# Altium project PCB_Project1.PrjPCB (part 2 of 2)
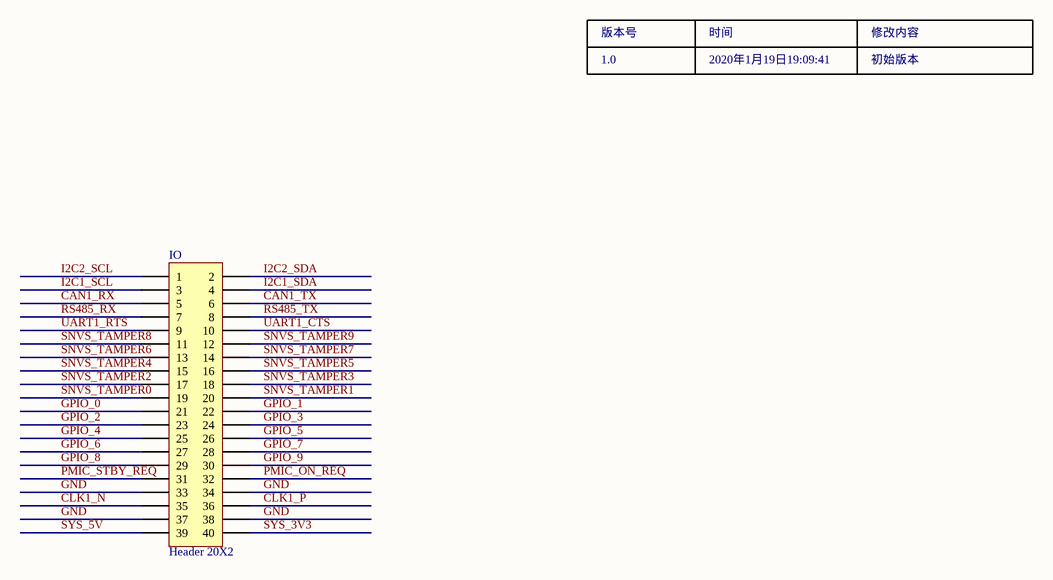
[diagram p12: 12_IO.SchDoc]

## Nets that join several sheets
DCDC_3V3: 01_POWER (10 pins), 02_BTB_IO (U3.77 U3.78 U3.79 U3.80)
GND: 01_POWER (23 pins), 02_BTB_IO (43 pins), 03_ENET (29 pins), 05_USB (25 pins), 06_SDIO (11 pins), 07_AUDIO (36 pins), 08_PERIPHERAL (31 pins), 09_RGB_LCD (LCD.5 LCD.36), 10_HDMI (31 pins), 11_HDMI_CON (13 pins), 12_IO (IO.33 IO.34 IO.37 IO.38)
JTAG_5V: 01_POWER (D3.1), 02_BTB_IO (P2.10)
SYS_3V3: 01_POWER (Q11.3 R9.2), 02_BTB_IO (C102.2 R10.2 SPI.7), 03_ENET (C10.2 L3.1), 04_BOOT (8 pins), 05_USB (C28.1 R46.2 U6.4 U6.16), 06_SDIO (Q6.2 R55.1 R57.1 SW_WIFI.1), 07_AUDIO (7 pins), 08_PERIPHERAL (23 pins), 09_RGB_LCD (5 pins), 10_HDMI (13 pins), 11_HDMI_CON (D12.1), 12_IO (IO.40)
SYS_5V: 01_POWER (5 pins), 02_BTB_IO (U3.150), 05_USB (10 pins), 07_AUDIO (C46.1 C47.1 U9.21 U9.26), 08_PERIPHERAL (C77.2 U11.3), 09_RGB_LCD (LCD.1 LCD.2), 11_HDMI_CON (C97.1 HDMI.18 R101.2 R102.2), 12_IO (IO.39)
USB_OTG1_VBUS: 01_POWER (D4.1), 02_BTB_IO (U3.149), 05_USB (D6.2 OTG1.3 USB_OTG.1)
USB_UART_5V: 01_POWER (D5.1), 05_USB (USB_UART.1)
AUDIO_INT: 02_BTB_IO (U3.63), 07_AUDIO (R60.1), 12_IO (IO.15)
BEEP: 02_BTB_IO (U3.68), 08_PERIPHERAL (R86.2), 12_IO (IO.20)
BOOT_MODE0: 02_BTB_IO (U3.69), 04_BOOT (BOOT.1)
BOOT_MODE1: 02_BTB_IO (U3.70), 04_BOOT (BOOT.2)
CAN1_RX: 02_BTB_IO (U3.45), 08_PERIPHERAL (UART_SW.7), 12_IO (IO.5)
CAN1_TX: 02_BTB_IO (U3.46), 08_PERIPHERAL (UART_SW.5), 12_IO (IO.6)
CLK1_N: 02_BTB_IO (U3.137), 12_IO (IO.35)
CLK1_P: 02_BTB_IO (U3.138), 12_IO (IO.36)
CSI_DATA0: 02_BTB_IO (U3.115), 08_PERIPHERAL (CSI.16)
CSI_DATA1: 02_BTB_IO (U3.116), 08_PERIPHERAL (CSI.15)
CSI_DATA2: 02_BTB_IO (U3.117), 08_PERIPHERAL (CSI.14)
CSI_DATA3: 02_BTB_IO (U3.118), 08_PERIPHERAL (CSI.13)
CSI_DATA4: 02_BTB_IO (U3.119), 08_PERIPHERAL (CSI.12)
CSI_DATA5: 02_BTB_IO (U3.120), 08_PERIPHERAL (CSI.11)
CSI_DATA6: 02_BTB_IO (U3.121), 08_PERIPHERAL (CSI.10)
CSI_DATA7: 02_BTB_IO (U3.122), 08_PERIPHERAL (CSI.9)
CSI_HSYNC: 02_BTB_IO (U3.114), 08_PERIPHERAL (CSI.6)
CSI_MCLK: 02_BTB_IO (U3.111), 08_PERIPHERAL (CSI.8)
CSI_PIXCLK: 02_BTB_IO (U3.112), 08_PERIPHERAL (CSI.7)
CSI_PWDN: 02_BTB_IO (U3.129), 08_PERIPHERAL (CSI.18), 12_IO (IO.25)
CSI_RST: 02_BTB_IO (U3.127), 08_PERIPHERAL (CSI.17), 12_IO (IO.23)
CSI_VSYNC: 02_BTB_IO (U3.113), 08_PERIPHERAL (CSI.5)
DDC_SCL: 10_HDMI (U13.49), 11_HDMI_CON (HDMI.15 R101.1)
DDC_SDA: 10_HDMI (U13.48), 11_HDMI_CON (HDMI.16 R102.1)
ENET1_CRS_DV: 02_BTB_IO (U3.90), 03_ENET (U4.11)
ENET1_nINT: 02_BTB_IO (U3.64), 03_ENET (R15.1 U4.14), 12_IO (IO.16)
ENET1_RST: 02_BTB_IO (U3.62), 03_ENET (C17.2 R16.1 U4.15), 12_IO (IO.14)
ENET1_RXD0: 02_BTB_IO (U3.87), 03_ENET (U4.8)
ENET1_RXD1: 02_BTB_IO (U3.88), 03_ENET (U4.7)
ENET1_RXER: 02_BTB_IO (U3.89), 03_ENET (R14.1 U4.10)
ENET1_TX_CLK: 02_BTB_IO (U3.86), 03_ENET (U4.5)
ENET1_TXD0: 02_BTB_IO (U3.83), 03_ENET (U4.17)
ENET1_TXD1: 02_BTB_IO (U3.84), 03_ENET (U4.18)
ENET1_TXEN: 02_BTB_IO (U3.85), 03_ENET (U4.16)
ENET2_CRS_DV: 02_BTB_IO (U3.100), 03_ENET (U5.11)
ENET2_nINT: 02_BTB_IO (U3.61), 03_ENET (R26.1 U5.14), 12_IO (IO.13)
ENET2_RST: 02_BTB_IO (U3.59), 03_ENET (C20.2 R27.1 U5.15), 12_IO (IO.11)
ENET2_RXD0: 02_BTB_IO (U3.97), 03_ENET (U5.8)
ENET2_RXD1: 02_BTB_IO (U3.98), 03_ENET (U5.7)
ENET2_RXER: 02_BTB_IO (U3.99), 03_ENET (R25.1 U5.10)
ENET2_TX_CLK: 02_BTB_IO (U3.96), 03_ENET (U5.5)
ENET2_TXD0: 02_BTB_IO (U3.93), 03_ENET (U5.17)
ENET2_TXD1: 02_BTB_IO (U3.94), 03_ENET (U5.18)
ENET2_TXEN: 02_BTB_IO (U3.95), 03_ENET (U5.16)
ENET_MDC: 02_BTB_IO (U3.132), 03_ENET (R12.1 U4.13 U5.13), 12_IO (IO.28)
ENET_MDIO: 02_BTB_IO (U3.131), 03_ENET (R13.1 U4.12 U5.12), 12_IO (IO.27)
GPIO_0: 02_BTB_IO (U3.125), 05_USB (Q2.3 R46.1), 12_IO (IO.21)
GPIO_1: 02_BTB_IO (U3.126), 06_SDIO (D8.2), 12_IO (IO.22)
GPIO_3: 02_BTB_IO (U3.128), 08_PERIPHERAL (LED0.K), 12_IO (IO.24)
GPIO_5: 02_BTB_IO (U3.130), 12_IO (IO.26)
GPIO_8: 02_BTB_IO (U3.133), 10_HDMI (U13.36), 12_IO (IO.29)
GPIO_9: 02_BTB_IO (U3.134), 09_RGB_LCD (LCD.35), 12_IO (IO.30)
HDMI_CEC_A: 10_HDMI (U13.71), 11_HDMI_CON (HDMI.13 R100.1)
HDMI_HPD: 10_HDMI (U13.54), 11_HDMI_CON (HDMI.19 R103.2)
HDMI_INT: 02_BTB_IO (U3.56), 10_HDMI (R99.1 U13.52), 12_IO (IO.10)
HDMI_TX0_N: 10_HDMI (U13.61), 11_HDMI_CON (HDMI.9 U16.4)
HDMI_TX0_P: 10_HDMI (U13.62), 11_HDMI_CON (HDMI.7 U16.6)
HDMI_TX1_N: 10_HDMI (U13.64), 11_HDMI_CON (HDMI.6 U15.4)
HDMI_TX1_P: 10_HDMI (U13.65), 11_HDMI_CON (HDMI.4 U15.6)
HDMI_TX2_N: 10_HDMI (U13.67), 11_HDMI_CON (HDMI.3 U15.3)
HDMI_TX2_P: 10_HDMI (U13.68), 11_HDMI_CON (HDMI.1 U15.1)
HDMI_TXC_N: 10_HDMI (U13.58), 11_HDMI_CON (HDMI.12 U16.3)
HDMI_TXC_P: 10_HDMI (U13.59), 11_HDMI_CON (HDMI.10 U16.1)
I2C1_SCL: 02_BTB_IO (U3.43), 07_AUDIO (U9.17), 08_PERIPHERAL (U10.23 U17.4), 09_RGB_LCD (R89.1), 12_IO (IO.3)
I2C1_SDA: 02_BTB_IO (U3.44), 07_AUDIO (U9.18), 08_PERIPHERAL (U10.24 U17.3), 09_RGB_LCD (R90.1), 12_IO (IO.4)
I2C2_SCL: 02_BTB_IO (U3.41), 08_PERIPHERAL (CSI.3), 09_RGB_LCD (LCD.40), 10_HDMI (R66.1 R97.1), 12_IO (IO.1)
I2C2_SDA: 02_BTB_IO (U3.42), 08_PERIPHERAL (CSI.4), 09_RGB_LCD (LCD.39), 10_HDMI (R67.1 R96.1), 12_IO (IO.2)
JTAG_MOD: 02_BTB_IO (U3.108), 08_PERIPHERAL (U10.12)
JTAG_nTRST: 02_BTB_IO (U3.107), 07_AUDIO (R64.1)
JTAG_TCK: 02_BTB_IO (P2.5 R11.2 U3.103), 07_AUDIO (R63.1)
JTAG_TDI: 02_BTB_IO (P2.3 U3.105), 07_AUDIO (R62.1)
JTAG_TDO: 02_BTB_IO (P2.8 U3.106), 07_AUDIO (R61.1)
JTAG_TMS: 02_BTB_IO (P2.4 U3.104), 07_AUDIO (R65.1)
KEY: 02_BTB_IO (U3.67), 08_PERIPHERAL (C81.2 KEY.1 R84.1), 12_IO (IO.19)
LCD_DATA0: 02_BTB_IO (U3.29), 09_RGB_LCD (LCD.22), 10_HDMI (U13.32)
LCD_DATA1: 02_BTB_IO (U3.30), 09_RGB_LCD (LCD.23), 10_HDMI (U13.31)
LCD_DATA2: 02_BTB_IO (U3.27), 09_RGB_LCD (LCD.24), 10_HDMI (U13.30)
LCD_DATA3: 02_BTB_IO (U3.28), 09_RGB_LCD (LCD.25), 10_HDMI (U13.29)
LCD_DATA4: 02_BTB_IO (U3.25), 04_BOOT (BOOT.3), 09_RGB_LCD (LCD.26), 10_HDMI (U13.28)
LCD_DATA5: 02_BTB_IO (U3.26), 04_BOOT (BOOT.4), 09_RGB_LCD (LCD.27), 10_HDMI (U13.27)
LCD_DATA6: 02_BTB_IO (U3.23), 04_BOOT (BOOT.5), 09_RGB_LCD (LCD.28), 10_HDMI (U13.25)
LCD_DATA7: 02_BTB_IO (U3.24), 04_BOOT (BOOT.6), 09_RGB_LCD (LCD.29), 10_HDMI (U13.24)
LCD_DATA8: 02_BTB_IO (U3.19), 09_RGB_LCD (LCD.14), 10_HDMI (U13.23)
LCD_DATA9: 02_BTB_IO (U3.20), 09_RGB_LCD (LCD.15), 10_HDMI (U13.20)
LCD_DATA10: 02_BTB_IO (U3.17), 09_RGB_LCD (LCD.16), 10_HDMI (U13.19)
LCD_DATA11: 02_BTB_IO (U3.18), 04_BOOT (BOOT.7), 09_RGB_LCD (LCD.17), 10_HDMI (U13.18)
LCD_DATA12: 02_BTB_IO (U3.15), 09_RGB_LCD (LCD.18), 10_HDMI (U13.17)
LCD_DATA13: 02_BTB_IO (U3.16), 04_BOOT (BOOT.8), 09_RGB_LCD (LCD.19), 10_HDMI (U13.16)
LCD_DATA14: 02_BTB_IO (U3.13), 09_RGB_LCD (LCD.20), 10_HDMI (U13.15)
LCD_DATA15: 02_BTB_IO (U3.14), 09_RGB_LCD (LCD.21), 10_HDMI (U13.14)
LCD_DATA16: 02_BTB_IO (U3.9), 09_RGB_LCD (LCD.6), 10_HDMI (U13.13)
LCD_DATA17: 02_BTB_IO (U3.10), 09_RGB_LCD (LCD.7), 10_HDMI (U13.11)
LCD_DATA18: 02_BTB_IO (U3.7), 09_RGB_LCD (LCD.8), 10_HDMI (U13.10)
LCD_DATA19: 02_BTB_IO (U3.8), 09_RGB_LCD (LCD.9), 10_HDMI (U13.9)
LCD_DATA20: 02_BTB_IO (U3.5), 09_RGB_LCD (LCD.10), 10_HDMI (U13.8)
LCD_DATA21: 02_BTB_IO (U3.6), 09_RGB_LCD (LCD.11), 10_HDMI (U13.7)
LCD_DATA22: 02_BTB_IO (U3.3), 09_RGB_LCD (LCD.12), 10_HDMI (U13.6)
LCD_DATA23: 02_BTB_IO (U3.4), 09_RGB_LCD (LCD.13), 10_HDMI (U13.4)
LCD_DE: 02_BTB_IO (U3.38), 09_RGB_LCD (LCD.33), 10_HDMI (U13.33)
LCD_HSYNC: 02_BTB_IO (U3.35), 09_RGB_LCD (LCD.31), 10_HDMI (U13.34)
LCD_INT: 02_BTB_IO (U3.60), 09_RGB_LCD (LCD.38), 12_IO (IO.12)
LCD_PCLK: 02_BTB_IO (U3.37), 09_RGB_LCD (LCD.30), 10_HDMI (R93.2)
LCD_RST: 02_BTB_IO (U3.33), 09_RGB_LCD (LCD.37), 10_HDMI (R94.1 U13.51)
LCD_VSYNC: 02_BTB_IO (U3.36), 09_RGB_LCD (LCD.32), 10_HDMI (U13.35)
NRF_CE: 02_BTB_IO (SPI.6 U3.66), 12_IO (IO.18)
ONOFF: 02_BTB_IO (U3.74), 08_PERIPHERAL (C80.2 ONOFF.1 R83.1)
PMIC_ON_REQ: 01_POWER (D11.2), 02_BTB_IO (U3.72), 12_IO (IO.32)
PMIC_STBY_REQ: 02_BTB_IO (U3.71), 12_IO (IO.31)
POR_B: 02_BTB_IO (5 pins), 06_SDIO (D7.2)
RS485_RX: 02_BTB_IO (U3.47), 08_PERIPHERAL (UART_SW.11), 12_IO (IO.7)
RS485_TX: 02_BTB_IO (U3.48), 08_PERIPHERAL (UART_SW.9), 12_IO (IO.8)
SD1_CLK: 02_BTB_IO (U3.158), 06_SDIO (SD1.5 U8.12)
SD1_CMD: 02_BTB_IO (U3.157), 06_SDIO (SD1.3 U8.10)
SD1_DATA0: 02_BTB_IO (U3.153), 06_SDIO (SD1.7 U8.13)
SD1_DATA1: 02_BTB_IO (U3.154), 06_SDIO (SD1.8 U8.14)
SD1_DATA2: 02_BTB_IO (U3.155), 06_SDIO (SD1.1 U8.8)
SD1_DATA3: 02_BTB_IO (U3.156), 06_SDIO (SD1.2 U8.9)
SDCARD_CD: 02_BTB_IO (U3.55), 06_SDIO (SD1.9), 12_IO (IO.9)
SNVS_TAMPER2: 02_BTB_IO (U3.65), 06_SDIO (U8.2), 12_IO (IO.17)
UART1_RXD: 02_BTB_IO (U3.58), 08_PERIPHERAL (UART_SW.1)
UART1_RXD_U: 05_USB (U6.2), 08_PERIPHERAL (UART_SW.2)
UART1_TXD: 02_BTB_IO (U3.57), 08_PERIPHERAL (UART_SW.3)
UART1_TXD_U: 05_USB (U6.3), 08_PERIPHERAL (UART_SW.4)
USB_OTG1_N: 02_BTB_IO (U3.147), 05_USB (OTG1.2 USB_OTG.A7 USB_OTG.B7)
USB_OTG1_P: 02_BTB_IO (U3.145), 05_USB (OTG1.1 USB_OTG.A6 USB_OTG.B6)
USB_OTG2_N: 02_BTB_IO (U3.148), 05_USB (U7.15)
USB_OTG2_P: 02_BTB_IO (U3.146), 05_USB (U7.16)